# EAGLE design core-controller (EAGLE 8.6.3)
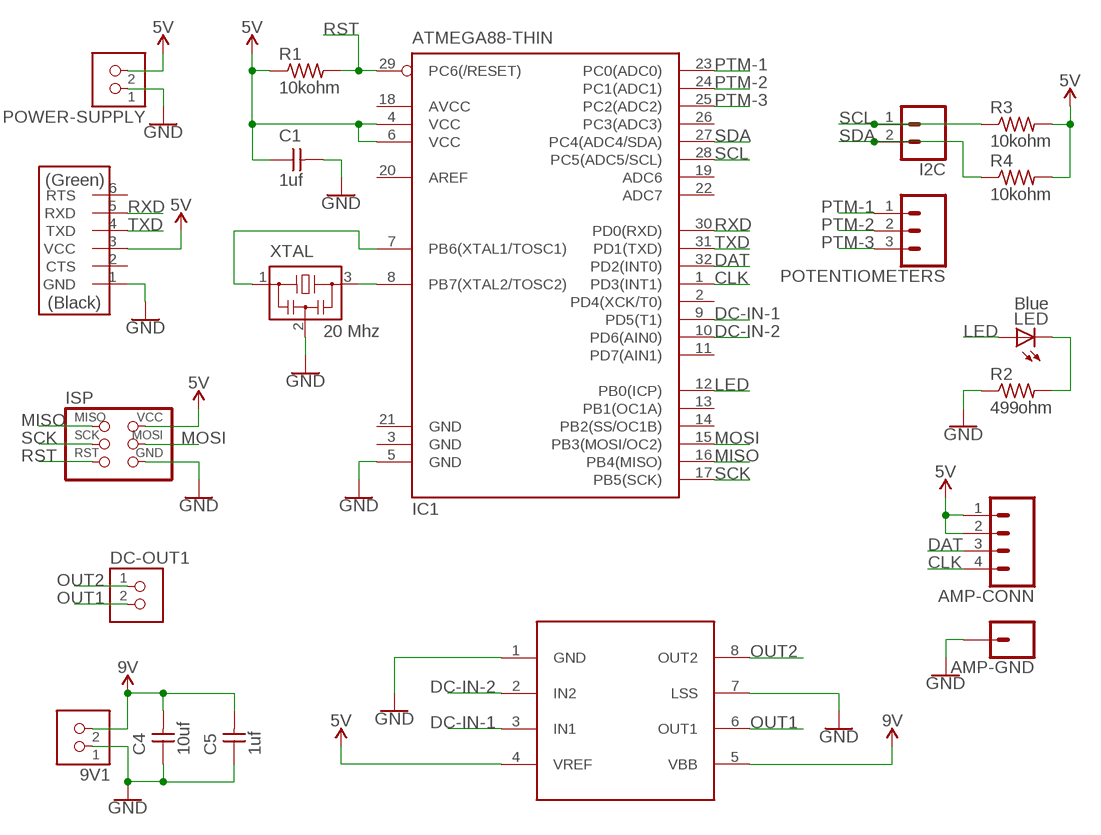
[diagram p0: schematic, sheet 1]

## Parts
9V1  TERM-1X02-FABLAB  [ED555DS-2DS]
AMP-CONN  CONN_041X04_NO_SILK  [1X04_NO_SILK]
AMP-GND  CONN_01PTH_NO_SILK_YES_STOP  [1X01_NO_SILK]
C1  1uf  CAP-UNPOLARIZEDFAB  [C1206FAB]
C4  10uf  CAP-UNPOLARIZEDFAB  [C1206FAB]
C5  1uf  CAP-UNPOLARIZEDFAB  [C1206FAB]
DC-OUT1  TERM-1X02-FABLAB  [ED555DS-2DS]
FTDI  FTDI  FTDI-SMD-HEADER  [1X06SMD]
I2C  CONN_021X02_NO_SILK  [1X02_NO_SILK]
IC1  ATMEGA88-THIN  [TQFP32-08THIN]
ISP  AVRISPSMD  [2X03SMD]
LED  Blue  LEDFAB1206  [LED1206FAB]
POTENTIOMETERS  CONN_031X03_NO_SILK  [1X03_NO_SILK]
POWER-SUPPLY  TERM-1X02-FABLAB  [ED555DS-2DS]
R1  10kohm  RES-US1206FAB  [R1206FAB]
R2  499ohm  RES-US1206FAB  [R1206FAB]
R3  10kohm  RES-US1206FAB  [R1206FAB]
R4  10kohm  RES-US1206FAB  [R1206FAB]
U$2  A4953  A4953-H-BRIDGE-MOTOR-DRIVER  [SOIC8]
XTAL  20 Mhz  RESONATOR  [EFOBM]

## Nets
5V: AMP-CONN.1 AMP-CONN.2 C1.1 FTDI.3(VCC) IC1.4(VCC) IC1.6(VCC) ISP.2(VCC) POWER-SUPPLY.2 R1.1 R3.2 R4.2 U$2.4(VREF)
CLK: AMP-CONN.4 IC1.1(PD3(INT1))
DAT: AMP-CONN.3 IC1.32(PD2(INT0))
DC-IN-1: IC1.9(PD5(T1)) U$2.3(IN1)
DC-IN-2: IC1.10(PD6(AIN0)) U$2.2(IN2)
GND: 9V1.1 AMP-GND.1 C1.2 C4.1 C5.1 FTDI.1(GND) IC1.5(GND) ISP.6(GND) POWER-SUPPLY.1 R2.1 U$2.1(GND) U$2.7(LSS) XTAL.2
LED: IC1.12(PB0(ICP)) LED.1(A)
MISO: IC1.16(PB4(MISO)) ISP.1(MISO)
MOSI: IC1.15(PB3(MOSI/OC2)) ISP.4(MOSI)
N$1: IC1.7(PB6(XTAL1/TOSC1)) XTAL.1
N$2: IC1.8(PB7(XTAL2/TOSC2)) XTAL.3
N$5: LED.2(C) R2.2
OUT1: DC-OUT1.2 U$2.6(OUT1)
OUT2: DC-OUT1.1 U$2.8(OUT2)
PTM-1: IC1.23(PC0(ADC0)) POTENTIOMETERS.1
PTM-2: IC1.24(PC1(ADC1)) POTENTIOMETERS.2
PTM-3: IC1.25(PC2(ADC2)) POTENTIOMETERS.3
RST: IC1.29(PC6(/RESET)) ISP.5(RST) R1.2
RXD: FTDI.5(RXD) IC1.30(PD0(RXD))
SCK: IC1.17(PB5(SCK)) ISP.3(SCK)
SCL: I2C.1 IC1.28(PC5(ADC5/SCL)) R3.1
SDA: I2C.2 IC1.27(PC4(ADC4/SDA)) R4.1
TXD: FTDI.4(TXD) IC1.31(PD1(TXD))
VDD: 9V1.2 C4.2 C5.2 U$2.5(VBB) ; supply symbol labelled 9V
Unconnected: FTDI.2(CTS) FTDI.6(RTS) IC1.2(PD4(XCK/T0)) IC1.11(PD7(AIN1)) IC1.13(PB1(OC1A)) IC1.14(PB2(SS/OC1B)) IC1.19(ADC6) IC1.20(AREF) IC1.22(ADC7) IC1.26(PC3(ADC3))

## Power pins joined to a net without a drawn wire
AVCC: IC1.18(AVCC)
GND: IC1.3(GND) IC1.21(GND)

## Library data of the parts
9V1 DC-OUT1 POWER-SUPPLY = fab:TERM-1X02: 3.5mm terminal block, 2 positions ED555-2DS as found in the fablab inventory. Stolen from Adafruit <http://www.ladyada.net/library/pcb/eaglelibrary.html>, adapted by Zaerc.
AMP-CONN = SparkFun-Connectors:CONN_04: Multi connection point. Often used as Generic Header-pin footprint for 0.1 inch spaced/style header connections On any of the 0.1 inch spaced packages, you can populate with these: Break Away Headers - Straight <https://www.sparkfun.com/products/116> (PRT-00116) Break Away Male Headers - Right Angle <https://www.sparkfun.com/products/553> (PRT-00553) Female Headers <https://www.sparkfun.com/products/115> (PRT-00115) Break Away Headers - Machine Pin <https://www.sparkfun.com/products/117> (PRT-00117) Break Away Female Headers - Swiss Machine Pin <https://www.sparkfun.com/products/743> (PRT-00743) For SCREWTERMINALS and SPRING TERMINALS visit here: Screw Terimnals on SparkFun.com <https://www.sparkfun.com/search/results?term=Screw+Terminals> (5mm/3.5mm/2.54mm spacing) This device is also useful as a general connection point to wire up your design to another part of your project. Our various solder wires solder well into these plated through hole pads. Hook-Up Wire - Assortment (Stranded, 22 AWG) <https://www.sparkfun.com/products/11375> (PRT-11375) Hook-Up Wire - Assortment (Solid Core, 22 AWG) <https://www.sparkfun.com/products/11367> (PRT-11367) View the entire wire category on our website here <https://www.sparkfun.com/categories/141> Special notes: Molex polarized connector foot print use with SKU : PRT-08231 with associated crimp pins and housings. 1MM SMD Version SKU: PRT-10208; PROD_ID: CONN-09696
AMP-GND = SparkFun-Connectors:CONN_01: Single connection point. Often used as Generic Header-pin footprint for 0.1 inch spaced/style header connections On any of the 0.1 inch spaced packages, you can populate with these: Break Away Headers - Straight <https://www.sparkfun.com/products/116> (PRT-00116) Break Away Male Headers - Right Angle <https://www.sparkfun.com/products/553> (PRT-00553) Female Headers <https://www.sparkfun.com/products/115> (PRT-00115) Break Away Headers - Machine Pin <https://www.sparkfun.com/products/117> (PRT-00117) Break Away Female Headers - Swiss Machine Pin <https://www.sparkfun.com/products/743> (PRT-00743) This device is also useful as a general connection point to wire up your design to another part of your project. Our various solder wires solder well into these plated through hole pads. Hook-Up Wire - Assortment (Stranded, 22 AWG) <https://www.sparkfun.com/products/11375> (PRT-11375) Hook-Up Wire - Assortment (Solid Core, 22 AWG) <https://www.sparkfun.com/products/11367> (PRT-11367) View the entire wire category on our website here <https://www.sparkfun.com/categories/141> Special notes: SMTSO-256-ET is a "flush mount" nut for a 4-40 screw. We mostly use this on specialty testbeds; it is a nice way to connect hardware to your PCB at an adjustable hieght. Also note, the SNAP packages are for using a snappable style connector. We sell a baggie of snaps and they are also used on two LilyPad designs: Snap Assortment - 30 pack (male and female) <https://www.sparkfun.com/products/11347> (DEV-11347) LilyPad Arduino SimpleSnap <https://www.sparkfun.com/products/10941> (DEV-10941) LilyPad SimpleSnap Protoboard <https://www.sparkfun.com/products/10940> (DEV-10940)
C1 C4 C5 = fab:CAP-UNPOLARIZED
FTDI = fab:FTDI-SMD-HEADER
I2C = SparkFun-Connectors:CONN_02: Multi connection point. Often used as Generic Header-pin footprint for 0.1 inch spaced/style header connections On any of the 0.1 inch spaced packages, you can populate with these: Break Away Headers - Straight <https://www.sparkfun.com/products/116> (PRT-00116) Break Away Male Headers - Right Angle <https://www.sparkfun.com/products/553> (PRT-00553) Female Headers <https://www.sparkfun.com/products/115> (PRT-00115) Break Away Headers - Machine Pin <https://www.sparkfun.com/products/117> (PRT-00117) Break Away Female Headers - Swiss Machine Pin <https://www.sparkfun.com/products/743> (PRT-00743) For SCREWTERMINALS and SPRING TERMINALS visit here: Screw Terimnals on SparkFun.com <https://www.sparkfun.com/search/results?term=Screw+Terminals> (5mm/3.5mm/2.54mm spacing) This device is also useful as a general connection point to wire up your design to another part of your project. Our various solder wires solder well into these plated through hole pads. Hook-Up Wire - Assortment (Stranded, 22 AWG) <https://www.sparkfun.com/products/11375> (PRT-11375) Hook-Up Wire - Assortment (Solid Core, 22 AWG) <https://www.sparkfun.com/products/11367> (PRT-11367) View the entire wire category on our website here <https://www.sparkfun.com/categories/141> Special notes: Molex polarized connector foot print use with: PRT-08233 with associated crimp pins and housings. 2.54_SCREWTERM for use with PRT-10571. 3.5mm Screw Terminal footprints for PRT-08084 5mm Screw Terminal footprints for use with PRT-08432
IC1 = fab:ATMEGA88-THIN
ISP = fab:AVRISP
LED = fab:LED: LED
POTENTIOMETERS = SparkFun-Connectors:CONN_03: Multi connection point. Often used as Generic Header-pin footprint for 0.1 inch spaced/style header connections On any of the 0.1 inch spaced packages, you can populate with these: Break Away Headers - Straight <https://www.sparkfun.com/products/116> (PRT-00116) Break Away Male Headers - Right Angle <https://www.sparkfun.com/products/553> (PRT-00553) Female Headers <https://www.sparkfun.com/products/115> (PRT-00115) Break Away Headers - Machine Pin <https://www.sparkfun.com/products/117> (PRT-00117) Break Away Female Headers - Swiss Machine Pin <https://www.sparkfun.com/products/743> (PRT-00743) Stackable Header - 3 Pin (Female, 0.1") <https://www.sparkfun.com/products/13875> (PRT-13875) For SCREWTERMINALS and SPRING TERMINALS visit here: Screw Terimnals on SparkFun.com <https://www.sparkfun.com/search/results?term=Screw+Terminals> (5mm/3.5mm/2.54mm spacing) This device is also useful as a general connection point to wire up your design to another part of your project. Our various solder wires solder well into these plated through hole pads. Hook-Up Wire - Assortment (Stranded, 22 AWG) <https://www.sparkfun.com/products/11375> (PRT-11375) Hook-Up Wire - Assortment (Solid Core, 22 AWG) <https://www.sparkfun.com/products/11367> (PRT-11367) View the entire wire category on our website here <https://www.sparkfun.com/categories/141> Special notes: Molex polarized connector foot print use with SKU : PRT-08232 with associated crimp pins and housings.
R1-R4 = fab:RES-US: Resistor (US Symbol) Variants with postfix FAB are widened to allow the routing of internal traces
U$2 = fab:A4953-H-BRIDGE-MOTOR-DRIVER
XTAL = fab:RESONATOR

## Board
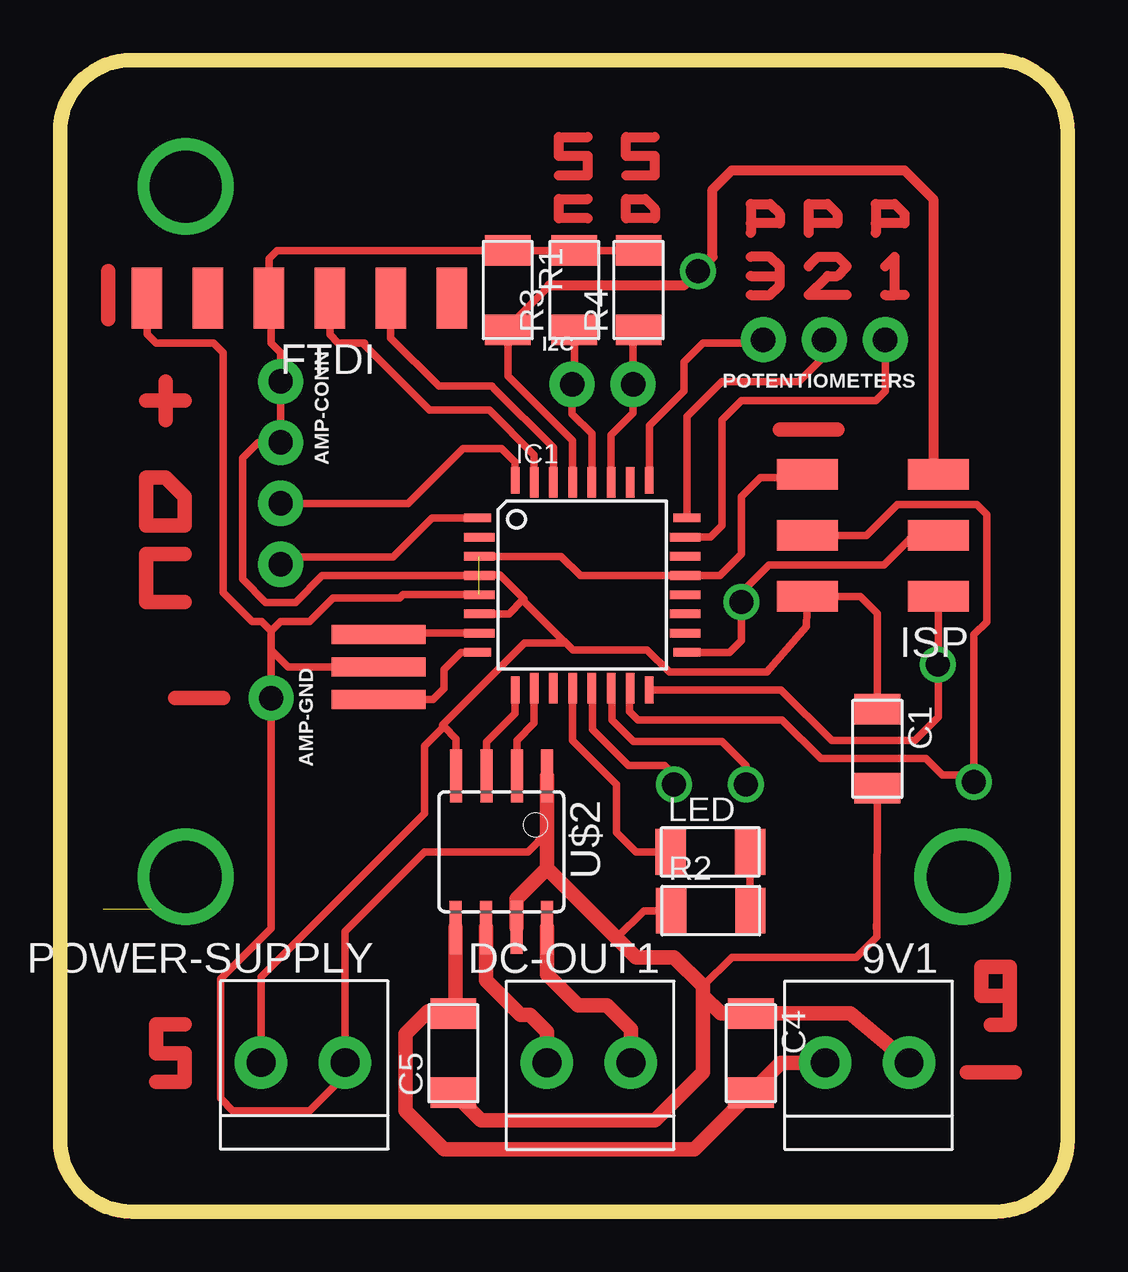
[diagram p1: board, top side]

Size 42 x 48 mm. Coordinates in mm from the lower left corner, seen from the top.
Copper layers (1*16): Top 0.035mm / dielectric 1.5mm / Bottom 0.035mm
Design rules "default *": minimum track width 6mil, minimum drill 0.35mm, track to track 17mil, track to pad 17mil, pad to pad 17mil, via to via 17mil, smd to smd 15.625mil, copper to edge 40mil, drill to drill 6mil, minimum pad ring 10mil, minimum via ring 8mil, stop-mask expansion 4mil, vias tented up to drill 0mil, thermal gap 10mil
Milling: area 0,0 to 42,48

### Footprints (pad centres in the part's own frame; a part is rotated, then mirrored left to right if it is on the bottom)
ED555DS-2DS = drill 1.2 pad 2.184: 1 1.8,0; 2 -1.7,0
1X04_NO_SILK = drill 1.016 pad 1.88: 1 0,0; 2 2.54,0; 3 5.08,0; 4 7.62,0
1X01_NO_SILK = drill 1.016 pad 1.88: 1 0,0
C1206FAB = smd 1.27 x 1.905: 1 -1.651,0; 2 1.651,0
1X06SMD = smd 2.54 x 1.27: 1 0,6.35; 2 0,3.81; 3 0,1.27; 4 0,-1.27; 5 0,-3.81; 6 0,-6.35
1X02_NO_SILK = drill 1.016 pad 1.88: 1 0,0; 2 2.54,0
TQFP32-08THIN = smd 1.118 x 0.356: 1 -4.369,2.8; 8 -4.369,-2.8; 17 4.369,-2.8; 24 4.369,2.8 | smd 1.27 x 0.356: 2 -4.293,2; 3 -4.293,1.2; 4 -4.293,0.4; 5 -4.293,-0.4; 6 -4.293,-1.2; 7 -4.293,-2; 18 4.293,-2; 19 4.293,-1.2; 20 4.293,-0.4; 21 4.293,0.4; 22 4.293,1.2; 23 4.293,2 | smd 0.356 x 1.118: 9 -2.8,-4.369; 16 2.8,-4.369; 25 2.8,4.369; 32 -2.8,4.369 | smd 0.356 x 1.27: 10 -2,-4.293; 14 1.2,-4.293; 15 2,-4.293; 26 2,4.293; 27 1.2,4.293; 31 -2,4.293 | smd 0.35 x 1.27: 11 -1.2,-4.293; 12 -0.4,-4.293; 13 0.4,-4.293; 28 0.4,4.293; 29 -0.4,4.293; 30 -1.2,4.293
2X03SMD = smd 2.54 x 1.27: 1 -2.54,2.54; 2 2.92,2.54; 3 -2.54,0; 4 2.92,0; 5 -2.54,-2.54; 6 2.92,-2.54
LED1206FAB = smd 1.27 x 1.905: 1 -1.651,0; 2 1.651,0
1X03_NO_SILK = drill 1.016 pad 1.88: 1 0,0; 2 2.54,0; 3 5.08,0
R1206FAB = smd 1.27 x 1.905: 1 -1.651,0; 2 1.651,0
SOIC8 = smd 0.5 x 2.2: 1 -1.905,-3.154; 2 -0.645,-3.154; 3 0.625,-3.154; 4 1.895,-3.154; 5 1.905,3.154; 6 0.635,3.154; 7 -0.635,3.154; 8 -1.905,3.154
EFOBM = smd 0.8 x 3.9: 1 -1.35,0; 2 0,0; 3 1.35,0

### Placement (x,y rotation side)
9V1  33.6,6.2 0 top
AMP-CONN  9.2,34.6 270 top
AMP-GND  8.8,21.4 270 top
C1  34.07,19.29 270 top
C4  28.8,6.6 270 top
C5  16.4,6.6 90 top
DC-OUT1  22,6.2 0 top
FTDI  9.98,38.07 90 top
I2C  21.35,34.48 0 top
IC1  21.77,26.11 0 top
ISP  34.07,28.18 180 top
LED  27.11,14.99 0 top
POTENTIOMETERS  34.4,36.34 180 top
POWER-SUPPLY  10.08,6.21 0 top
R1  18.67,38.41 270 top
R2  27.13,12.54 0 top
R3  21.44,38.41 90 top
R4  24.12,38.41 90 top
U$2  18.4,15 180 top
XTAL  13.28,22.7 270 top

### Tracks (layer width: path | path; a pad name or v marks a point on that pad's centre or on a via)
5V
  Top 0.152: R1.1 19.46,40.06
  Top 0.305: C1.1 34.07,24.93 33.36,25.64 ISP.2 31.1,24.4 30.7,23.91 29.48,22.48 25.4,22.48 24.47,23.41 21.38,23.41 21.09,23.69 | R4.2 R3.2 19.46,40.06 | 19.29,25.49 20.89,23.89 21.09,23.69 | IC1.6 18.71,24.91 19.29,25.49 | 19.29,25.49 19.34,25.54 18.34,26.54 17.51,26.54 IC1.4 10.94,26.51 9.82,25.39 8.58,25.39 7.61,26.36 7.61,31.41 8.26,32.06 AMP-CONN.2 AMP-CONN.1 9.2,35.8 8.8,36.2 8.8,37.98 FTDI.3 8.71,39.71 9.06,40.06 R1.1 | 16,20.21 16.51,19.7 U$2.4 | POWER-SUPPLY.2 8.38,9.78 15.2,16.6 15.2,19.41 16,20.21 | 21.09,23.69 19.36,23.69 15.94,20.27 16,20.21
CLK
  Top 0.305: IC1.1 15.51,28.91 13.88,27.28 9.5,27.28 AMP-CONN.4
DAT
  Top 0.305: IC1.32 18.97,31.23 18.4,31.8 16.8,31.8 14.52,29.52 AMP-CONN.3
DC-IN-1
  Top 0.305: IC1.9 18.97,20.77 17.77,19.58 U$2.3
DC-IN-2
  Top 0.305: IC1.10 19.77,20.37 19.05,19.65 U$2.2
GND  (1 unrouted)
  Top 0.305: ISP.6 31.48,30.72 31.6,30.6 29.2,30.6 28.4,29.8 28.4,27.4 27.51,26.51 IC1.21 21.69,26.51 20.89,27.31 IC1.3 | C1.2 34.04,12.2 | 34.04,12.2 34.04,11.81 | 24,10.6 23.2,11.4 24.34,12.54 R2.1 | 34.04,12.2 34.04,11.44 33.2,10.6 28,10.6 26.8,9.4 | FTDI.1 3.63,36.57 4,36.2 6.4,36.2 6.8,35.8 6.8,25.8 8,24.6 8.4,24.6 8.8,24.2 | 8.8,24.2 8.8,23.4 | 8.8,23.4 AMP-GND.1 8.8,11.8 6.69,9.69 6.69,4.71 7.2,4.2 10.4,4.2 11.88,5.68 POWER-SUPPLY.1 11.88,11.68 15.2,15 19.51,15 20.3,15.8 | XTAL.2 9.5,22.7 8.8,23.4 | IC1.5 14.3,25.71 14.16,25.58 11.39,25.58 10.41,24.59 9.19,24.59 8.8,24.2
  Top 0.61: C5.1 17.55,3.8 24.8,3.8 26.8,5.8 26.8,9 | 26.8,9 26.8,9.4 25.6,10.6 24,10.6 20.3,14.3 | U$2.1 20.3,15.8 20.3,14.3 | U$2.7 19.03,13.02 20.3,14.3 | 9V1.1 32.95,8.25 C4.1 27.55,8.25 26.8,9
LED
  Top 0.305: IC1.12 21.37,19.63 23.2,17.8 23.2,15.8 24.01,14.99 LED.1
MISO
  Top 0.305: IC1.16 30.06,21.74 32.17,19.63 35.63,19.63 36.61,20.61 36.61,21.21 36.61,21.4 ISP.1
MOSI  (via drill 1 pad 1.3)
  Top 0.305: ISP.4 33.62,28.18 34.91,29.47 38.21,29.47 38.63,29.04 38.63,24.58 38.1,24.04 38.1,18.2 | 38.1,18.2 v38.1,17.9 | 38.1,18.2 36.78,18.2 36.1,18.88 31.72,18.88 30.1,20.5 24.09,20.5 23.74,20.85 23.74,21.79 IC1.15
N$1
  Top 0.305: IC1.7 12.54,24.11 XTAL.1
N$2
  Top 0.305: IC1.8 16.71,23.31 16,22.6 16,21.8 15.55,21.35 XTAL.3
N$3  (1 unrouted)
  Top 0.61: 2,37.2 2,39.2 | 39.8,5.8 37.8,5.8
N$4
  Top 0.61: 4,5.4 5.2,5.4 5.2,6.6 4,6.6 4,7.8 5.2,7.8
N$5
  Top 0.305: LED.2 28.76,12.56 R2.2
N$6
  Top 0.61: 4.4,34.6 4.4,33
N$7
  Top 0.61: 5.2,33.8 3.6,33.8
N$8
  Top 0.61: 3.6,30.6 3.6,28.6 5.2,28.6 5.2,29.8 4.4,30.6 3.6,30.6
N$9
  Top 0.61: 5.2,27.4 3.6,27.4 3.6,25.4 5.2,25.4
N$10
  Top 0.61: 6.8,21.4 4.8,21.4
N$11  (via drill 3)
  other vias: 37.63,13.96
N$12  (via drill 3)
  other vias: 5.24,13.96
N$13  (via drill 3)
  other vias: 5.24,42.72
N$18
  Top 0.61: 30,32.6 32.4,32.6
N$19
  Top 0.406: 28.8,38.2 29.6,38.2 30,38.6 30,39 | 28.8,39 30,39 | 30,39 30,39.4 29.6,39.8 28.8,39.8
N$20
  Top 0.406: 28.8,41.19 28.8,41.99 29.6,41.99 30,41.59 30,41.19 28.8,41.19 | 28.8,41.19 28.8,40.79
N$21
  Top 0.406: 20.8,43.19 22,43.19 22,43.99 20.8,43.99 20.8,44.79 22,44.79
N$22
  Top 0.406: 32.8,38.2 31.2,38.2 32,39 32.4,39 32.8,39.4 32.4,39.8 31.6,39.8 31.2,39.4
N$23
  Top 0.406: 34.4,38.2 34.8,38.2 | 35.2,38.2 34.8,38.2 | 34.8,38.2 34.8,39.8 34.4,39.4
N$24
  Top 0.406: 31.2,41.19 31.2,41.99 32,41.99 32.4,41.59 32.4,41.19 31.2,41.19 | 31.2,41.19 31.2,40.79
N$25
  Top 0.406: 34,41.19 34,41.99 34.8,41.99 35.2,41.59 35.2,41.19 34,41.19 | 34,41.19 34,40.79
N$26
  Top 0.406: 22,41.4 20.8,41.4 20.8,42.2 22,42.2
N$27
  Top 0.406: 23.6,41.4 23.6,42.2 24.4,42.2 24.8,41.8 24.8,41.4 23.6,41.4
N$28
  Top 0.406: 23.6,43.19 24.8,43.19 24.8,43.99 23.6,43.99 23.6,44.79 24.8,44.79
N$37  (via drill 1 pad 1.3)
  Top 0.305: 22.2,21.6 22.2,20.1 23.7,18.6 25.2,18.6 25.6,18.2 v25.6,17.8 25.6,17.6
N$38  (via drill 1 pad 1.3)
  Top 0.305: 23,21.6 23,20.5 23.9,19.6 27.6,19.6 28.6,18.6 v28.6,17.8 28.6,17.6
N$39  (via drill 1 pad 1.3)
  other vias: 36.6,22.8
N$54
  Top 0.61: 39.6,8.99 38.4,8.99 38.4,10.19 39.6,10.19 39.6,8.99 | 39.6,8.99 39.6,7.79 38.8,7.79
OUT1
  Top 0.61: U$2.6 17.77,9.64 19.2,8.2 19.6,8.2 20.3,7.5 DC-OUT1.2
OUT2
  Top 0.61: U$2.8 20.3,9.89 21.6,8.6 22.8,8.6 23.8,7.6 DC-OUT1.1
PTM-1
  Top 0.305: POTENTIOMETERS.1 34.4,34.2 34,33.8 28.4,33.8 27.6,33 27.6,28.6 27.11,28.11 IC1.23
PTM-2
  Top 0.305: POTENTIOMETERS.2 31.86,35.66 30.8,34.6 27.6,34.6 26.14,33.14 IC1.24
PTM-3
  Top 0.305: POTENTIOMETERS.3 29.18,36.2 26.8,36.2 26,35.4 26,34.2 24.57,32.77 IC1.25
RST  (via drill 1 pad 1.3)
  Top 0.305: IC1.29 21.37,32.13 18.67,34.83 R1.2 18.67,36.87 20.4,38.6
  Top 0.406: ISP.5 36.4,30.93 36.4,42.2 35.2,43.4 28,43.4 27.2,42.6 27.2,39.8 v26.6,39.2 26,38.6 20.4,38.6
RXD
  Top 0.305: FTDI.5 13.79,36.41 15.8,34.4 18,34.4 18.1,34.3 20.57,31.84 IC1.30
SCK  (via drill 1 pad 1.3)
  Top 0.305: ISP.3 35.58,28.18 34.34,26.94 29.55,26.94 29.55,26.95 28.4,25.8 v28.4,25.4 28.4,23.8 27.91,23.31 IC1.17
SCL
  Top 0.305: IC1.28 22.17,32.43 21.35,33.25 21.35,34.2 | 21.35,34.2 I2C.1 | R3.1 21.44,34.29 21.35,34.2
SDA
  Top 0.305: IC1.27 22.97,32.37 23.89,33.29 I2C.2 23.89,36.53 R4.1
TXD
  Top 0.305: FTDI.4 11.25,36.55 11.6,36.2 12.69,36.2 12.69,36.12 15.41,33.4 17.9,33.4 19.77,31.53 IC1.31
VDD
  Top 0.61: U$2.5 16.49,8.35 | 16.49,8.35 C5.2 | 9V1.2 30.05,6.2 C4.2 26.45,2.6 16,2.6 14.4,4.2 14.4,7.4 15.35,8.35 16.49,8.35